# Altium schematic sheet User_Interface.SchDoc
size A
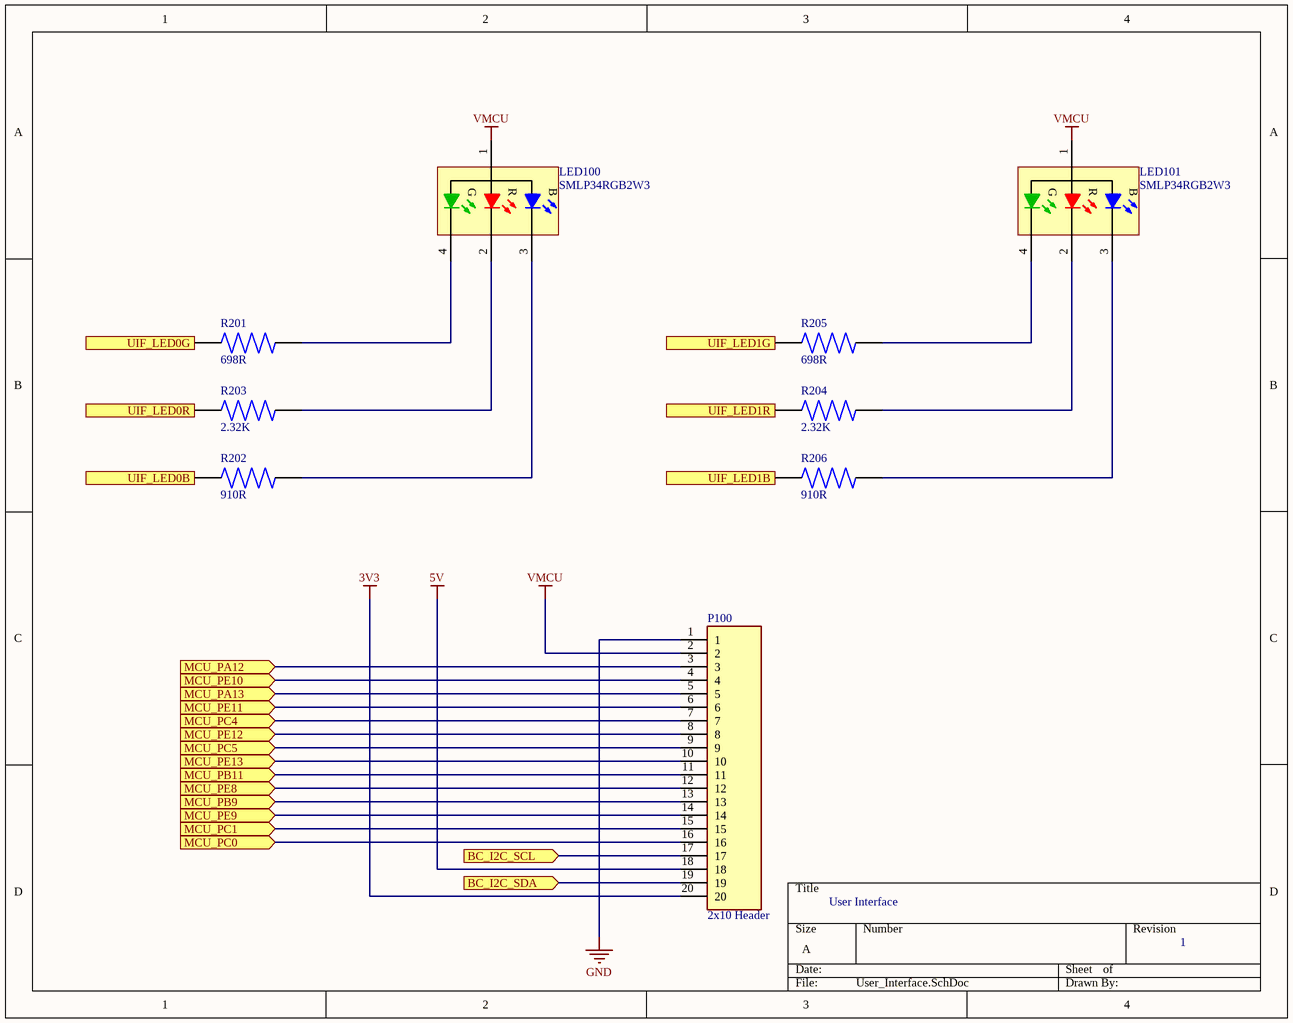
[diagram p0: User_Interface.SchDoc]

## Parts
LED100  SMLP34RGB2W3  [ROHM-SMLP34-4_V]
LED101  SMLP34RGB2W3  [ROHM-SMLP34-4_V]
P100  2x10 Header  [2x10 Header]
R201  698R  [R0603 Vishay]
R202  910R  [R0402 Vishay]
R203  2.32K  [R0805 Vishay]
R204  2.32K  [R0805 Vishay]
R205  698R  [R0603 Vishay]
R206  910R  [R0402 Vishay]

## Ports
BC_I2C_SCL (in), BC_I2C_SDA (in), MCU_PA12 (in), MCU_PA13 (in), MCU_PB9 (in), MCU_PB11 (in), MCU_PC0 (in), MCU_PC1 (in), MCU_PC4 (in), MCU_PC5 (in), MCU_PE8 (in), MCU_PE9 (in), MCU_PE10 (in), MCU_PE11 (in), MCU_PE12 (in), MCU_PE13 (in), UIF_LED0B (in), UIF_LED0G (in), UIF_LED0R (in), UIF_LED1B (in), UIF_LED1G (in), UIF_LED1R (in)

## Nets
3V3: P100.20
5V: P100.18
GND: P100.1
VMCU: LED100.1(A) LED101.1(A) P100.2
BC_I2C_SCL: P100.17 ; port BC_I2C_SCL
BC_I2C_SDA: P100.19 ; port BC_I2C_SDA
MCU_PA12: P100.3 ; port MCU_PA12
MCU_PA13: P100.5 ; port MCU_PA13
MCU_PB9: P100.13 ; port MCU_PB9
MCU_PB11: P100.11 ; port MCU_PB11
MCU_PC0: P100.16 ; port MCU_PC0
MCU_PC1: P100.15 ; port MCU_PC1
MCU_PC4: P100.7 ; port MCU_PC4
MCU_PC5: P100.9 ; port MCU_PC5
MCU_PE8: P100.12 ; port MCU_PE8
MCU_PE9: P100.14 ; port MCU_PE9
MCU_PE10: P100.4 ; port MCU_PE10
MCU_PE11: P100.6 ; port MCU_PE11
MCU_PE12: P100.8 ; port MCU_PE12
MCU_PE13: P100.10 ; port MCU_PE13
UIF_LED0B: R202.1 ; port UIF_LED0B
UIF_LED0G: R201.1 ; port UIF_LED0G
UIF_LED0R: R203.1 ; port UIF_LED0R
UIF_LED1B: R206.1 ; port UIF_LED1B
UIF_LED1G: R205.1 ; port UIF_LED1G
UIF_LED1R: R204.1 ; port UIF_LED1R
NetLED100_2: LED100.2(R) R203.2
NetLED100_3: LED100.3(B) R202.2
NetLED100_4: LED100.4(G) R201.2
NetLED101_2: LED101.2(R) R204.2
NetLED101_3: LED101.3(B) R206.2
NetLED101_4: LED101.4(G) R205.2

## Notes on the sheet
- User Interface
- 1

## Library data of the parts
LED100 LED101 = SMLP34RGB2W3: PICOLED-RGB LED, 5 mA, -40 to 85 degC, 4-Pin 1 x 1 x 0.25 mm SMD, RoHS, Tape and Reel; Manufacturer: ROHM Semiconductor; VR(RGB): 5 V; VF(Blue): 3.2 V Typ.; VF(Green): 3.3 V Typ.; IF(RGB): 5 mA; IR(RGB): 10 uA Max.; VF(Red): 2.2 V Typ.; ComponentLink1Description: Manufacturer URL; ComponentLink2Description: Datasheet; PartNumber: SMLP34RGB2W3; DatasheetVersion: Rev. G; Mounting Technology: Surface Mount; ComponentLink1URL: http://www.rohm.com/; Packing: Tape and Reel; RoHS: TRUE; Temperature Range: -40 to 85 degC; PackageReference: SMLP34; PackageDescription: 4-Pin SMD, Body 1 x 1 mm, Pitch 0.85 mm; ComponentLink2URL: http://rohmfs.rohm.com/en/products/databook/datasheet/opto/led/chip_multi/smlp34.pdf
P100 = 2x10 Header: HE2P-20G6C394-5R, 2.54 mm pegs.; MP: 1-826944-0; Number_of_Positions: 20; Product_Type: Connector; MF: TE Connectivity; Centerline_Pitch: 2.54 mm[.1 in]; Package: None; TE_purchase_URL: https://www.te.com/usa-en/product-1-826944-0.html?te_bu=Cor&te_type=disp&te_campaign=seda_glo_cor-seda-global-disp-prtnr-fy19-seda-model-bom-cta_sma-317_1&elqCampaignId=32493; Price: None; EU_RoHS_Compliance: Compliant; Value: *; SnapEDA_Link: https://www.snapeda.com/parts/1-826944-0/TE%20Connectivity%20AMP%20Connectors/view-part/517829/?ref=snap; Availability: Unavailable
R201 R205 = CRCW0201698RFNED: RES SMD 698 OHM 1% 1/20W 0201; Manufacturer: Vishay; Power Rating: 50mW; Voltage Rating: 30V; Temperature Coefficient: 200ppm/°C; Supplier 1: Digi-Key; Manufacturer Part Number: CRCW0201698RFNED; RoHS: Yes; Category: Chip SMD Resistors; Stock 1: 10000; Pricing 1: 1=0.10000, 10=0.05700, 100=0.02300, 1000=0.01034, 2500=0.00897, 5000=0.00741 (USD); Case/Package: 0201; Case Code (Metric): 0603; Case Code (Imperial): 0201; Contact Plating: Tin; Min Operating Temperature: -55°C; Max Operating Temperature: 155°C; Packaging: Tape and Reel; Resistance: 698R; Tolerance: 1%; Package Quantity: 10000; Resistor Type: Thick Film; Number of Terminations: 2; Max Power Dissipation: 50mW; Voltage Rating (DC): 30V; Length: 0.024inch; Width: 0.012inch; Height: 0.011inch; Radiation Hardening: No; REACH SVHC: Unknown; Lead Free: Lead Free; ComponentLink1URL: https://datasheet.ciiva.com/2577/crcw0201e3-2577171.pdf?src-supplier=Digi-Key; ComponentLink1Description: https://datasheet.ciiva.com/2577/crcw0201e3-2577171.pdf?src-supplier=Digi-Key; ComponentLink2URL: https://datasheet.ciiva.com/8922/crcw0201e3-8922646.pdf?src-supplier=Avnet; ComponentLink2Description: https://datasheet.ciiva.com/8922/crcw0201e3-8922646.pdf?src-supplier=Avnet; ComponentLink3URL: https://datasheet.ciiva.com/7672/1719906-7672440.pdf?src-supplier=Element14; ComponentLink3Description: https://datasheet.ciiva.com/7672/1719906-7672440.pdf?src-supplier=Element14; ComponentLink4URL: https://datasheet.ciiva.com/7672/1719906-7672441.pdf?src-supplier=Element14; ComponentLink4Description: https://datasheet.ciiva.com/7672/1719906-7672441.pdf?src-supplier=Element14; ComponentLink5URL: https://datasheet.ciiva.com/22674/1700795-22674828.pdf?src-supplier=Element14; ComponentLink5Description: https://datasheet.ciiva.com/22674/1700795-22674828.pdf?src-supplier=Element14; Supplier Part Number 1: 541-CRCW0201698RFNEDCT-ND
R202 R206 = CRCW0402910RFKED: Res Thick Film 0402 910 Ohm 1% 0.063W(1/16W) ±100ppm/C Pad SMD Automotive T/R; Manufacturer: Vishay; Temperature Coefficient: 100ppm/°C; Power Rating: 63mW; Voltage Rating: 50V; Supplier 1: Digi-Key; Manufacturer Part Number: CRCW0402910RFKED; RoHS: Yes; Category: Chip SMD Resistors; Stock 1: 32719; Pricing 1: 1=0.10000, 10=0.03300, 100=0.01330, 1000=0.00596, 2500=0.00518, 5000=0.00428 (USD); Case/Package: 0402; Contact Plating: Tin; Weight: 2.3E-05oz; Case Code (Imperial): 0402; Case Code (Metric): 1005; Min Operating Temperature: -55°C; Max Operating Temperature: 155°C; Resistance: 910R; Tolerance: 1%; Resistor Type: Thick Film; Packaging: Tape and Reel; Package Quantity: 10; Termination: SMD/SMT; Number of Terminations: 2; Max Power Dissipation: 63mW; Features: Automotive AEC-Q200; Voltage Rating (DC): 50V; Length: 1mm; Width: 0.5mm; Height: 0.35mm; Depth: 0.5mm; Radiation Hardening: No; Lead Free: Lead Free; REACH SVHC: Unknown; Military Standard: Not; ComponentLink1URL: https://datasheet.ciiva.com/11818/0900766b80d98824-11818156.pdf?src-supplier=RSComponents; ComponentLink1Description: https://datasheet.ciiva.com/11818/0900766b80d98824-11818156.pdf?src-supplier=RSComponents; ComponentLink2URL: https://datasheet.ciiva.com/5545/dcrcwe3-109170-5545657.pdf?src-supplier=Mouser; ComponentLink2Description: https://datasheet.ciiva.com/5545/dcrcwe3-109170-5545657.pdf?src-supplier=Mouser; ComponentLink3URL: https://datasheet.ciiva.com/22674/1847332-22674841.pdf?src-supplier=Element14; ComponentLink3Description: https://datasheet.ciiva.com/22674/1847332-22674841.pdf?src-supplier=Element14; ComponentLink4URL: https://datasheet.ciiva.com/2463/dcrcwe3-2463999.pdf?src-supplier=Digi-Key; ComponentLink4Description: https://datasheet.ciiva.com/2463/dcrcwe3-2463999.pdf?src-supplier=Digi-Key; ComponentLink5URL: https://datasheet.ciiva.com/7672/1697337-7672517.pdf?src-supplier=Element14; ComponentLink5Description: https://datasheet.ciiva.com/7672/1697337-7672517.pdf?src-supplier=Element14; ComponentLink6URL: https://datasheet.ciiva.com/16778/70201119-16778533.pdf?src-supplier=Allied+Electronics; ComponentLink6Description: https://datasheet.ciiva.com/16778/70201119-16778533.pdf?src-supplier=Allied+Electronics; ComponentLink7URL: https://datasheet.ciiva.com/16426/dcrcwe3-16426299.pdf?src-supplier=Future+Electronics; ComponentLink7Description: https://datasheet.ciiva.com/16426/dcrcwe3-16426299.pdf?src-supplier=Future+Electronics; ComponentLink8URL: https://datasheet.ciiva.com/22706/1697337-22706347.pdf?src-supplier=Element14; ComponentLink8Description: https://datasheet.ciiva.com/22706/1697337-22706347.pdf?src-supplier=Element14; ComponentLink9URL: https://datasheet.ciiva.com/2463/dcrcwe3-2463997.pdf?src-supplier=Digi-Key; ComponentLink9Description: https://datasheet.ciiva.com/2463/dcrcwe3-2463997.pdf?src-supplier=Digi-Key; ComponentLink10URL: https://datasheet.ciiva.com/2463/dcrcwe3-2463998.pdf?src-supplier=Digi-Key; ComponentLink10Description: https://datasheet.ciiva.com/2463/dcrcwe3-2463998.pdf?src-supplier=Digi-Key; ComponentLink11URL: https://datasheet.ciiva.com/7672/1697337-7672518.pdf?src-supplier=Element14; ComponentLink11Description: https://datasheet.ciiva.com/7672/1697337-7672518.pdf?src-supplier=Element14; Supplier Part Number 1: 541-910LCT-ND
R203 R204 = CRCW08052K32FKEA: VISHAY - CRCW08052K32FKEA - RES, THICK FILM, 2K32, 1%, 0.125W, 0805; Resistance: 2.32kR; Temperature Coefficient: 100ppm/°C; Max Power Dissipation: 125mW; Voltage Rating: 150V; Supplier 1: Digi-Key; Manufacturer: Vishay; Manufacturer Part Number: CRCW08052K32FKEA; RoHS: Yes; Category: Chip SMD Resistors; Stock 1: 20040; Pricing 1: 1=0.10000, 10=0.05700, 100=0.02310, 1000=0.01039, 2500=0.00902 (USD); Case/Package: 0805; Number of Pins: 2; Contact Plating: Tin; Weight: 0.000194oz; Case Code (Imperial): 0805; Case Code (Metric): 2012; Min Operating Temperature: -55°C; Max Operating Temperature: 155°C; Tolerance: 1%; Resistor Type: Thick Film; Packaging: Tape and Reel; Number of Terminations: 2; Package Quantity: 10; Features: Automotive AEC-Q200; Power Rating: 125mW; Termination: SMD/SMT; Voltage Rating (DC): 150V; Length: 2mm; Width: 1.25mm; Height: 0.02inch; Depth: 1.25mm; Radiation Hardening: No; Lead Free: Lead Free; REACH SVHC: Unknown; Military Standard: Not; ComponentLink1URL: https://datasheet.ciiva.com/16435/dcrcwe3-16435909.pdf?src-supplier=Future+Electronics; ComponentLink1Description: https://datasheet.ciiva.com/16435/dcrcwe3-16435909.pdf?src-supplier=Future+Electronics; ComponentLink2URL: https://datasheet.ciiva.com/3258/dcrcwe3-3258438.pdf?src-supplier=Avnet; ComponentLink2Description: https://datasheet.ciiva.com/3258/dcrcwe3-3258438.pdf?src-supplier=Avnet; ComponentLink3URL: https://datasheet.ciiva.com/3258/dcrcwe3-3258439.pdf?src-supplier=Avnet; ComponentLink3Description: https://datasheet.ciiva.com/3258/dcrcwe3-3258439.pdf?src-supplier=Avnet; ComponentLink4URL: https://datasheet.ciiva.com/2525/dcrcwe3-2525755.pdf?src-supplier=Digi-Key; ComponentLink4Description: https://datasheet.ciiva.com/2525/dcrcwe3-2525755.pdf?src-supplier=Digi-Key; ComponentLink5URL: https://datasheet.ciiva.com/2525/dcrcwe3-2525756.pdf?src-supplier=Digi-Key; ComponentLink5Description: https://datasheet.ciiva.com/2525/dcrcwe3-2525756.pdf?src-supplier=Digi-Key; ComponentLink6URL: https://datasheet.ciiva.com/2525/dcrcwe3-2525757.pdf?src-supplier=Digi-Key; ComponentLink6Description: https://datasheet.ciiva.com/2525/dcrcwe3-2525757.pdf?src-supplier=Digi-Key; ComponentLink7URL: https://datasheet.ciiva.com/7670/1697337-7670286.pdf?src-supplier=Element14; ComponentLink7Description: https://datasheet.ciiva.com/7670/1697337-7670286.pdf?src-supplier=Element14; ComponentLink8URL: https://datasheet.ciiva.com/17201/dcrcwe3-17201132.pdf?src-supplier=Avnet+Europe; ComponentLink8Description: https://datasheet.ciiva.com/17201/dcrcwe3-17201132.pdf?src-supplier=Avnet+Europe; ComponentLink9URL: https://datasheet.ciiva.com/7670/1697337-7670285.pdf?src-supplier=Element14; ComponentLink9Description: https://datasheet.ciiva.com/7670/1697337-7670285.pdf?src-supplier=Element14; ComponentLink10URL: https://datasheet.ciiva.com/22675/1825492-22675197.pdf?src-supplier=Element14; ComponentLink10Description: https://datasheet.ciiva.com/22675/1825492-22675197.pdf?src-supplier=Element14; ComponentLink11URL: https://datasheet.ciiva.com/16769/70201119-16769374.pdf?src-supplier=Allied+Electronics; ComponentLink11Description: https://datasheet.ciiva.com/16769/70201119-16769374.pdf?src-supplier=Allied+Electronics; Supplier Part Number 1: 541-2.32KCCT-ND